# Altium schematic sheet DXP原理图.SchDoc
size A3
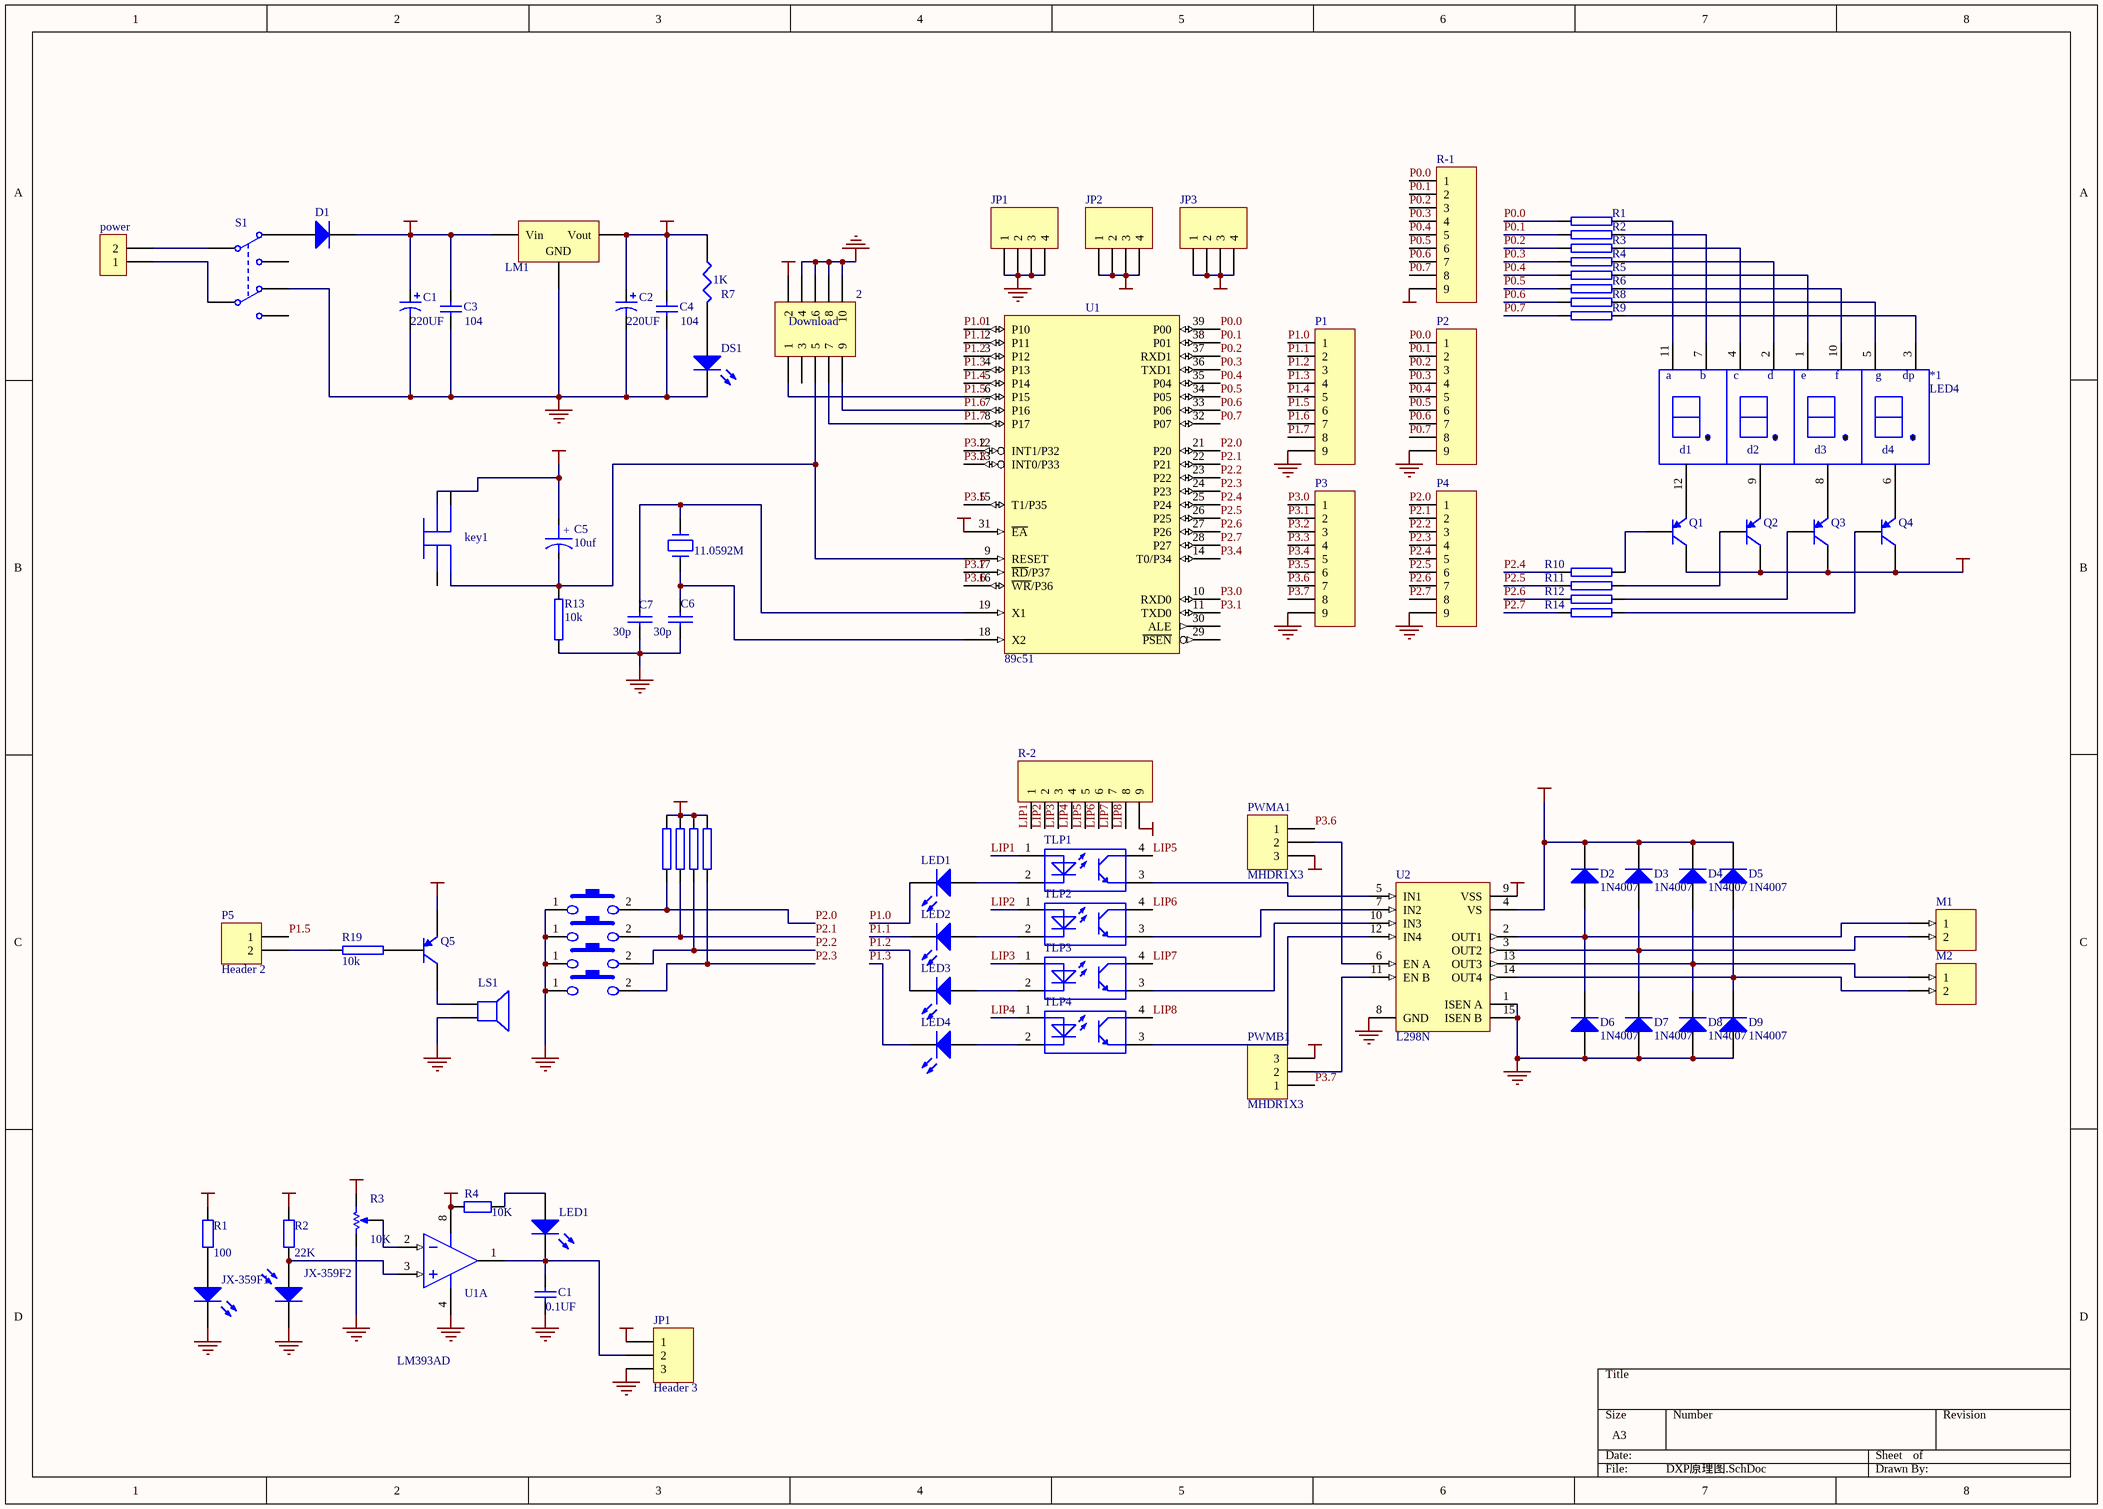
[diagram p0: DXP原理图.SchDoc]

## Parts
(Parts that share a designator on the sheet are numbered #1, #2 ... from top to bottom, then left to right.)
1  power  [DZ-2]
2  Download  [HDR2X5]
3  key1  [AN66]  (value not drawn)
4  key2  [AN66]  (value not drawn)
5  key3  [AN66]  (value not drawn)
6  key4  [AN66]  (value not drawn)
*1  LED4  [数码管-4]
C1#1  value 220UF  [CD6]
C1#2  value 0.1UF  [C1608-0603]
C2  value 220UF  [CD4]
C3  value 104  [HDR1X2]
C4  value 104  [HDR1X2]
C5  10uf  [CD5]
C6  30p  [C1608-0603]
C7  30p  [C1608-0603]
D1  (no value)  [DIO10.46-5.3x2.8]
D2  1N4007  [DIO7.8-4.6x2]
D3  1N4007  [DIO7.8-4.6x2]
D4  1N4007  [DIO7.8-4.6x2]
D5  1N4007  [DIO7.8-4.6x2]
D6  1N4007  [DIO7.8-4.6x2]
D7  1N4007  [DIO7.8-4.6x2]
D8  1N4007  [DIO7.8-4.6x2]
D9  1N4007  [DIO7.8-4.6x2]
DS1  (no value)  [HDR1X2]
JP1#1  (no value)  [HDR1X4]
JP1#2  Header 3  [HDR1X3]
JP2  (no value)  [HDR1X4]
JP3  (no value)  [HDR1X4]
JX-359F1  (no value)  [HDR1X2]
JX-359F2  (no value)  [HDR1X2]
key1  KEY  [AN66]  (value not drawn)
LED1#1  (no value)  [HDR1X2]
LED1#2  (no value)  [HDR1X2]
LED2  (no value)  [HDR1X2]
LED3  (no value)  [HDR1X2]
LED4  (no value)  [HDR1X2]
LM1  (no value)  [wyk]
LS1  (no value)  [SP]
M1  (no value)  [DZ-2]
M2  (no value)  [DZ-2]
P1  (no value)  [HDR1X9]
P2  (no value)  [HDR1X9]
P3  (no value)  [HDR1X9]
P4  (no value)  [HDR1X9]
P5  Header 2  [HDR1X2]
PWMA1  MHDR1X3  [MHDR1X3]
PWMB1  MHDR1X3  [MHDR1X3]
Q1  2N3906  [SO-G3/Z3.3]  (value not drawn)
Q2  2N3906  [SO-G3/C2.5]  (value not drawn)
Q3  2N3906  [SO-G3/C2.5]  (value not drawn)
Q4  2N3906  [SO-G3/C2.5]  (value not drawn)
Q5  2N3906  [SO-G3/Z3.3]  (value not drawn)
R1#1  470  [INDC2012-0805]  (value not drawn)
R1#2  value 100  [C1608-0603]
R2#1  470  [INDC2012-0805]  (value not drawn)
R2#2  value 22K  [C1608-0603]
R3#1  470  [INDC2012-0805]  (value not drawn)
R3#2  value 10K  [HDR1X3]
R4#1  470  [INDC2012-0805]  (value not drawn)
R4#2  value 10K  [C1608-0603]
R5  470  [INDC2012-0805]  (value not drawn)
R6  470  [INDC2012-0805]  (value not drawn)
R7  1K  [HDR1X2]
R8  470  [INDC2012-0805]  (value not drawn)
R9  470  [INDC2012-0805]  (value not drawn)
R10  470  [INDC2012-0805]  (value not drawn)
R11  470  [INDC2012-0805]  (value not drawn)
R12  470  [INDC2012-0805]  (value not drawn)
R13  10k  [INDC2012-0805]
R14  470  [INDC2012-0805]  (value not drawn)
R15  470  [INDC2012-0805]  (value not drawn)
R16  470  [INDC2012-0805]  (value not drawn)
R17  470  [INDC2012-0805]  (value not drawn)
R18  470  [INDC2012-0805]  (value not drawn)
R19  10k  [INDC2012-0805]
R-1  (no value)  [HDR1X9]
R-2  (no value)  [HDR1X9]
S1  (no value)  [DPDT-6]
TLP1  (no value)  [DIP4]
TLP2  (no value)  [DIP4]
TLP3  (no value)  [DIP4]
TLP4  (no value)  [DIP4]
U1#1  89c51  [DIP40]
U1#2  LM393AD  [SO8]  (part A of 2)
U2  L298N  [DFM-T15/X1.6V]
Y1  11.0592M  [SPST-2]

## Nets
+5V: 2.2 C2.1 C4.2 C5.1 JP2.1 JP2.2 JP2.3 JP2.4 key1.1 LM1.3(Vout) PWMA1.3 PWMB1.3 Q1.3(C) Q2.3(C) Q3.3(C) Q4.3(C) R7.1 R15.2 R16.2 R17.2 R18.2 R-1.9 R-2.9 U2.9(VSS)
+12V: C1#1.1 C3.2 D1.2(K) D2.2(K) D3.2(K) D4.2(K) D5.2(K) JP3.1 JP3.2 JP3.3 JP3.4 LM1.1(Vin) U2.4(VS)
GND: 2.4 2.6 2.8 2.10 3.1 4.1 5.1 6.1 C1#1.2 C1#2.1 C2.2 C3.1 C4.1 C6.2 C7.2 D6.1(A) D7.1(A) D8.1(A) D9.1(A) DS1.2(K) JP1#1.1 JP1#1.2 JP1#1.3 JP1#1.4 JP1#2.3 JX-359F1.2(K) JX-359F2.2(K) LM1.2(GND) LS1.2 P1.9 P2.9 P3.9 P4.9 R3#2.2(BOT) R13.2 S1.4(NC2) U1#1.20(GND) U1#2.4(V-) U2.1(ISEN_A) U2.8(GND) U2.15(ISEN_B)
VCC: JP1#2.1 Q5.1(E) R1#2.2 R2#2.2 R3#2.1(TOP) R4#2.2 U1#1.31(~{EA}) U1#1.40(VCC) U1#2.8(V+)
LIP1: R-2.1 TLP1.1
LIP2: R-2.2 TLP2.1
LIP3: R-2.3 TLP3.1
LIP4: R-2.4 TLP4.1
LIP5: R-2.5 TLP1.4
LIP6: R-2.6 TLP2.4
LIP7: R-2.7 TLP3.4
LIP8: R-2.8 TLP4.4
P0.0: P2.1 R1#1.1 R-1.1 U1#1.39(P00)
P0.1: P2.2 R2#1.1 R-1.2 U1#1.38(P01)
P0.2: P2.3 R3#1.1 R-1.3 U1#1.37(RXD1)
P0.3: P2.4 R4#1.1 R-1.4 U1#1.36(TXD1)
P0.4: P2.5 R5.1 R-1.5 U1#1.35(P04)
P0.5: P2.6 R6.1 R-1.6 U1#1.34(P05)
P0.6: P2.7 R8.1 R-1.7 U1#1.33(P06)
P0.7: P2.8 R9.1 R-1.8 U1#1.32(P07)
P1.0: LED1#1.2(K) P1.1 U1#1.1(P10)
P1.1: LED2.2(K) P1.2 U1#1.2(P11)
P1.2: LED3.2(K) P1.3 U1#1.3(P12)
P1.3: LED4.2(K) P1.4 U1#1.4(P13)
P1.4: P1.5 U1#1.5(P14)
P1.5: 2.1 P1.6 P5.1 U1#1.6(P15)
P1.6: 2.9 P1.7 U1#1.7(P16)
P1.7: 2.7 P1.8 U1#1.8(P17)
P2.0: 3.2 P4.1 R17.1 U1#1.21(P20)
P2.1: 4.2 P4.2 R18.1 U1#1.22(P21)
P2.2: 5.2 P4.3 R15.1 U1#1.23(P22)
P2.3: 6.2 P4.4 R16.1 U1#1.24(P23)
P2.4: P4.5 R10.1 U1#1.25(P24)
P2.5: P4.6 R11.1 U1#1.26(P25)
P2.6: P4.7 R12.1 U1#1.27(P26)
P2.7: P4.8 R14.1 U1#1.28(P27)
P3.0: P3.1 U1#1.10(RXD0)
P3.1: P3.2 U1#1.11(TXD0)
P3.2: P3.3 U1#1.12(INT1/P32)
P3.3: P3.4 U1#1.13(INT0/P33)
P3.4: P3.5 U1#1.14(T0/P34)
P3.5: P3.6 U1#1.15(T1/P35)
P3.6: P3.7 PWMA1.1 U1#1.16(~{WR}/P36)
P3.7: P3.8 PWMB1.1 U1#1.17(~{RD}/P37)
Net1_1: 1.1 S1.5(COMMON2)
Net1_2: 1.2 S1.1(COMMON1)
Net2_5: 2.5 C5.2 key1.2 R13.1 U1#1.9(RESET)
Net*1_1: *1.1 R5.2
Net*1_2: *1.2 R4#1.2
Net*1_3: *1.3 R9.2
Net*1_4: *1.4 R3#1.2
Net*1_5: *1.5 R8.2
Net*1_6: *1.6 Q4.1(E)
Net*1_7: *1.7 R2#1.2
Net*1_8: *1.8 Q3.1(E)
Net*1_9: *1.9 Q2.1(E)
Net*1_10: *1.10 R6.2
Net*1_11: *1.11 R1#1.2
Net*1_12: *1.12 Q1.1(E)
NetC1#2_2: C1#2.2 JP1#2.2 LED1#2.2(K) U1#2.1(OUT)
NetC6_1: C6.1 U1#1.18(X2) Y1.2
NetC7_1: C7.1 U1#1.19(X1) Y1.1
NetD1_1: D1.1(A) S1.2(NC1)
NetD2_1: D2.1(A) D6.2(K) M1.1 U2.2(OUT1)
NetD3_1: D3.1(A) D7.2(K) M1.2 U2.3(OUT2)
NetD4_1: D4.1(A) D8.2(K) M2.1 U2.13(OUT3)
NetD5_1: D5.1(A) D9.2(K) M2.2 U2.14(OUT4)
NetDS1_1: DS1.1(A) R7.2
NetJX-359F1_1: JX-359F1.1(A) R1#2.1
NetJX-359F2_1: JX-359F2.1(A) R2#2.1 U1#2.3(IN+)
NetLED1#1_1: LED1#1.1(A) TLP1.2
NetLED1#2_1: LED1#2.1(A) R4#2.1
NetLED2_1: LED2.1(A) TLP2.2
NetLED3_1: LED3.1(A) TLP3.2
NetLED4_1: LED4.1(A) TLP4.2
NetLS1_1: LS1.1 Q5.3(C)
NetP5_2: P5.2 R19.1
NetPWMA1_2: PWMA1.2 U2.6(EN_A)
NetPWMB1_2: PWMB1.2 U2.11(EN_B)
NetQ1_2: Q1.2(B) R10.2
NetQ2_2: Q2.2(B) R11.2
NetQ3_2: Q3.2(B) R12.2
NetQ4_2: Q4.2(B) R14.2
NetQ5_2: Q5.2(B) R19.2
NetR3#2_3: R3#2.3(TAP) U1#2.2(IN-)
NetTLP1_3: TLP1.3 U2.5(IN1)
NetTLP2_3: TLP2.3 U2.7(IN2)
NetTLP3_3: TLP3.3 U2.10(IN3)
NetTLP4_3: TLP4.3 U2.12(IN4)

Not connected (* = marked no-connect by the designer): 2 3; key1 0 3; S1 3(NO1) 6(NO2); U1#1 29(~{PSEN}) 30(ALE)

## Notes on the sheet
- (in symbol CAPACITOR POL) +
- (in symbol LED4) a; b; c; d; e; f; g; dp; d1; d2; d3; d4

## Library data of the parts
2 = Header 5X2: Header, 5-Pin, Dual row; Revision: 17-Jul-2002: Re-released for DXP Platform.; Publisher: Altium Limited
3-6 = key
C1#1 C2 = Cap Pol1: Polarized Capacitor (Radial); Published: 8-Jun-2000; LatestRevisionDate: 17-Jul-2002; LatestRevisionNote: Re-released for DXP Platform.; Publisher: Altium Limited
C1#2 = Cap Semi: Capacitor (Semiconductor SIM Model); Published: 8-Jun-2000; LatestRevisionDate: 17-Jul-2002; LatestRevisionNote: Re-released for DXP Platform.; PackageReference: C1206; Publisher: Altium Limited
C3 C4 = Cap: Capacitor; Published: 8-Jun-2000; LatestRevisionDate: 17-Jul-2002; LatestRevisionNote: Re-released for DXP Platform.; Publisher: Altium Limited
C5 = CAPACITOR POL: Capacitor
C6 C7 = CAP: Capacitor
D1-D9 = Diode 1N4007: 1 Amp General Purpose Rectifier; Published: 8-Jun-2000; LatestRevisionDate: 17-Jul-2002; LatestRevisionNote: Re-released for DXP Platform.; DatasheetDocument: 1998; PackageDocument: Aug-1999; PackageReference: DO-41; Publisher: Altium Limited; Code_JEDEC: DO-204-AL
DS1 = LED0: Typical INFRARED GaAs LED; Published: 8-Jun-2000; LatestRevisionDate: 17-Jul-2002; LatestRevisionNote: Re-released for DXP Platform.; Publisher: Altium Limited
JP1#1 JP2 JP3 = Header 4: Header, 4-Pin; Revision: 17-Jul-2002: Re-released for DXP Platform.; Publisher: Altium Limited
JP1#2 = Header 3: Header, 3-Pin; LatestRevisionDate: 17-Jul-2002; LatestRevisionNote: Re-released for DXP Platform.; Publisher: Altium Limited
JX-359F1 LED1#1 LED1#2 LED2-LED4 = LED3: Typical BLUE SiC LED; Published: 8-Jun-2000; LatestRevisionDate: 17-Dec-2003; LatestRevisionNote: PCB Footprint replaced.; Publisher: Altium Limited
JX-359F2 = Photo Sen: Photosensitive Diode; Published: 24-Mar-1999; LatestRevisionDate: 17-Jul-2002; LatestRevisionNote: Re-released for DXP Platform.; Publisher: Altium Limited
LM1 = Volt Reg: Voltage Regulator; Published: 24-Mar-1999; LatestRevisionDate: 17-Jul-2002; LatestRevisionNote: Re-released for DXP Platform.; Publisher: Altium Limited; Code_JEDEC: SMD-220
LS1 = Speaker: Loudspeaker; Published: 24-Mar-1999; Revision: July-2002: Re-released for DXP Platform.; Publisher: Altium Limited
M1 M2 = MHDR1X2: Header, 2-Pin; LatestRevisionDate: 17-Jul-2002; LatestRevisionNote: Re-released for DXP Platform.; Publisher: Altium Limited
P1-P4 R-1 R-2 = Header 9: Header, 9-Pin; Revision: 17-Jul-2002: Re-released for DXP Platform.; Publisher: Altium Limited
P5 = Header 2: Header, 2-Pin; LatestRevisionDate: 17-Jul-2002; LatestRevisionNote: Re-released for DXP Platform.; Publisher: Altium Limited
PWMA1 PWMB1 = MHDR1X3: Header, 3-Pin; LatestRevisionDate: 17-Jul-2002; LatestRevisionNote: Re-released for DXP Platform.; Publisher: Altium Limited
Q1-Q5 = 2N3906: PNP General Purpose Amplifier; Revision 1: 11-Jul-2000: SIM Model Added.; Revision 2: 17-Jul-2002: Re-released for DXP Platform.; Revision 3: 15-Jan-2003: PCB Footprint 'BCY-W3/D4.7' replaced; Code - JEDEC: TO-92A; Published: 8-Jun-2000; Datasheet: Latest Revision: 1997; Package Reference: TO-92A; Publisher: Altium Limited
R1#1 R2#1 R3#1 R4#1 R5 R6 R8-R19 = RES2
R1#2 R2#2 R4#2 = Res2: Resistor; Published: 8-Jun-2000; LatestRevisionDate: 17-Jul-2002; LatestRevisionNote: Re-released for DXP Platform.; Publisher: Altium Limited
R3#2 = RPot: Potentiometer; Sim Note: Enter the Resistance value and the set point into parameter fields.; Set Position: 0.5; Published: 8-Jun-2000; LatestRevisionDate: 17-Jul-2002; LatestRevisionNote: Re-released for DXP Platform.; Publisher: Altium Limited
R7 = RES1
S1 = SW DPDT: Switch; Published: 24-Mar-1999; LatestRevisionDate: 17-Jul-2002; LatestRevisionNote: Re-released for DXP Platform.; Publisher: Altium Limited
TLP1-TLP4 = TLP521-1
U1#1 = 8051
U1#2 = LM393AD: Low-Power Dual Voltage Comparator; Published: 24-Aug-2001; LatestRevisionDate: 6-Jun-2005; LatestRevisionNote: Stylized 3D Model Added.; DatasheetDocument: Nov-1992; PackageDocument: Jul-1998; PackageReference: SO8; Publisher: Altium Limited; Code_JEDEC: MS-012-AA; Code_IPC: SO8; ComponentLink1Description: Manufacturer Link; ComponentLink1URL: http://www.st.com/
U2 = L298N: Dual Full Bridge Driver; Published: 8-Jun-2000; LatestRevisionDate: 17-Jul-2002; LatestRevisionNote: Re-released for DXP Platform.; DatasheetDocument: Jul-1999; PackageDocument: Apr-1998; PackageReference: Multiwatt15H; Publisher: Altium Limited; ComponentLink1Description: Manufacturer Link; ComponentLink1URL: http://www.st.com/
Y1 = CRYSTAL